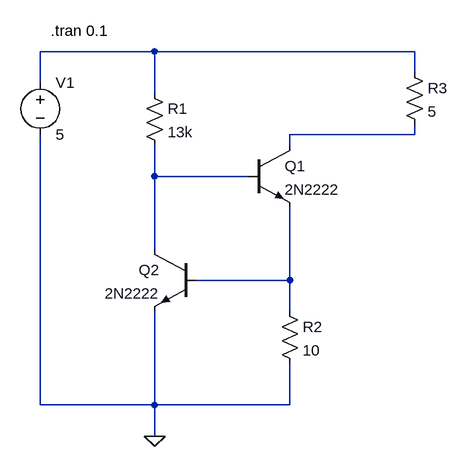
[diagram p0: schematic Current limiting.asc]
Current limiting.asc, the LTspice schematic file:
Version 4
SHEET 1 1044 680
WIRE 368 64 192 64
WIRE 768 64 368 64
WIRE 768 96 768 64
WIRE 192 112 192 64
WIRE 368 128 368 64
WIRE 768 192 768 176
WIRE 768 192 576 192
WIRE 576 208 576 192
WIRE 368 256 368 208
WIRE 512 256 368 256
WIRE 368 368 368 256
WIRE 576 416 576 304
WIRE 576 416 432 416
WIRE 576 464 576 416
WIRE 192 608 192 192
WIRE 368 608 368 464
WIRE 368 608 192 608
WIRE 576 608 576 544
WIRE 576 608 368 608
WIRE 368 656 368 608
FLAG 368 656 0
SYMBOL npn 512 208 R0
SYMATTR InstName Q1
SYMATTR Value 2N2222
SYMBOL npn 432 368 M0
SYMATTR InstName Q2
SYMATTR Value 2N2222
SYMBOL res 352 112 R0
SYMATTR InstName R1
SYMATTR Value 13k
SYMBOL res 560 448 R0
SYMATTR InstName R2
SYMATTR Value 10
SYMBOL voltage 192 96 R0
SYMATTR InstName V1
SYMATTR Value 5
SYMBOL res 752 80 R0
SYMATTR InstName R3
SYMATTR Value 5
TEXT 208 32 Left 2 !.tran 0.1

The netlist it stands for:
* Current limiting.asc
Q1 N002 N003 N004 0 2N2222
Q2 N003 N004 0 0 2N2222
R1 N001 N003 13k
R2 N004 0 10
V1 N001 0 5
R3 N001 N002 5
.model NPN NPN
.model PNP PNP
.lib standard.bjt
.tran 0.1
.backanno
.end